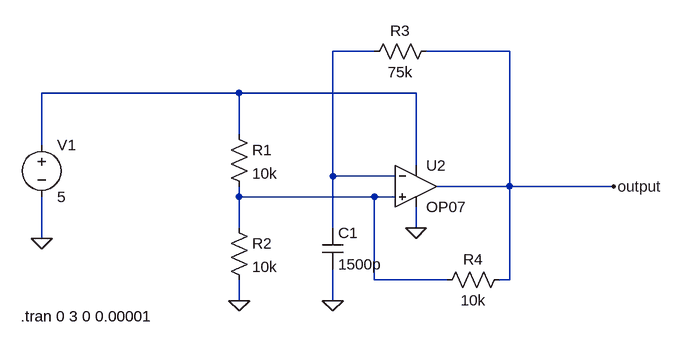
[diagram p0: schematic CR_OpAmp_Oscillator.asc]
CR_OpAmp_Oscillator.asc, the LTspice schematic file:
Version 4
SHEET 1 880 680
WIRE 144 -96 80 -96
WIRE 352 -96 224 -96
WIRE -64 -32 -368 -32
WIRE 208 -32 -64 -32
WIRE -64 32 -64 -32
WIRE -368 48 -368 -32
WIRE 208 80 208 -32
WIRE 80 96 80 -96
WIRE 176 96 80 96
WIRE 352 112 352 -96
WIRE 352 112 240 112
WIRE 512 112 352 112
WIRE -64 128 -64 112
WIRE 144 128 -64 128
WIRE 176 128 144 128
WIRE -64 176 -64 128
WIRE 80 176 80 96
WIRE 208 176 208 144
WIRE -368 192 -368 128
WIRE 144 256 144 128
WIRE 256 256 144 256
WIRE 352 256 352 112
WIRE 352 256 336 256
WIRE -64 288 -64 256
WIRE 80 288 80 240
FLAG -368 192 0
FLAG 208 176 0
FLAG 80 288 0
FLAG -64 288 0
FLAG 512 112 output
SYMBOL voltage -368 32 R0
WINDOW 123 0 0 Left 0
WINDOW 39 0 0 Left 0
SYMATTR InstName V1
SYMATTR Value 5
SYMBOL res -80 16 R0
SYMATTR InstName R1
SYMATTR Value 10k
SYMBOL res -80 160 R0
SYMATTR InstName R2
SYMATTR Value 10k
SYMBOL cap 64 176 R0
SYMATTR InstName C1
SYMATTR Value 1500p
SYMBOL res 240 -112 R90
WINDOW 0 0 56 VBottom 2
WINDOW 3 32 56 VTop 2
SYMATTR InstName R3
SYMATTR Value 75k
SYMBOL res 352 240 R90
WINDOW 0 0 56 VBottom 2
WINDOW 3 32 56 VTop 2
SYMATTR InstName R4
SYMATTR Value 10k
SYMBOL OpAmps\\OP07 208 48 R0
SYMATTR InstName U2
TEXT -400 312 Left 2 !.tran 0 3 0 0.00001

The netlist it stands for:
* CR_OpAmp_Oscillator.asc
V1 N002 0 5
R1 N002 N003 10k
R2 N003 0 10k
C1 N001 0 1500p
R3 output N001 75k
R4 output N003 10k
XU2 N003 N001 N002 0 output LT1001  ; OP07, pins In+ In- V+ V- OUT
.tran 0 3 0 0.00001
.lib LTC.lib
.backanno
.end